# EAGLE design PicKit2Clone2 (EAGLE 6.5.0)
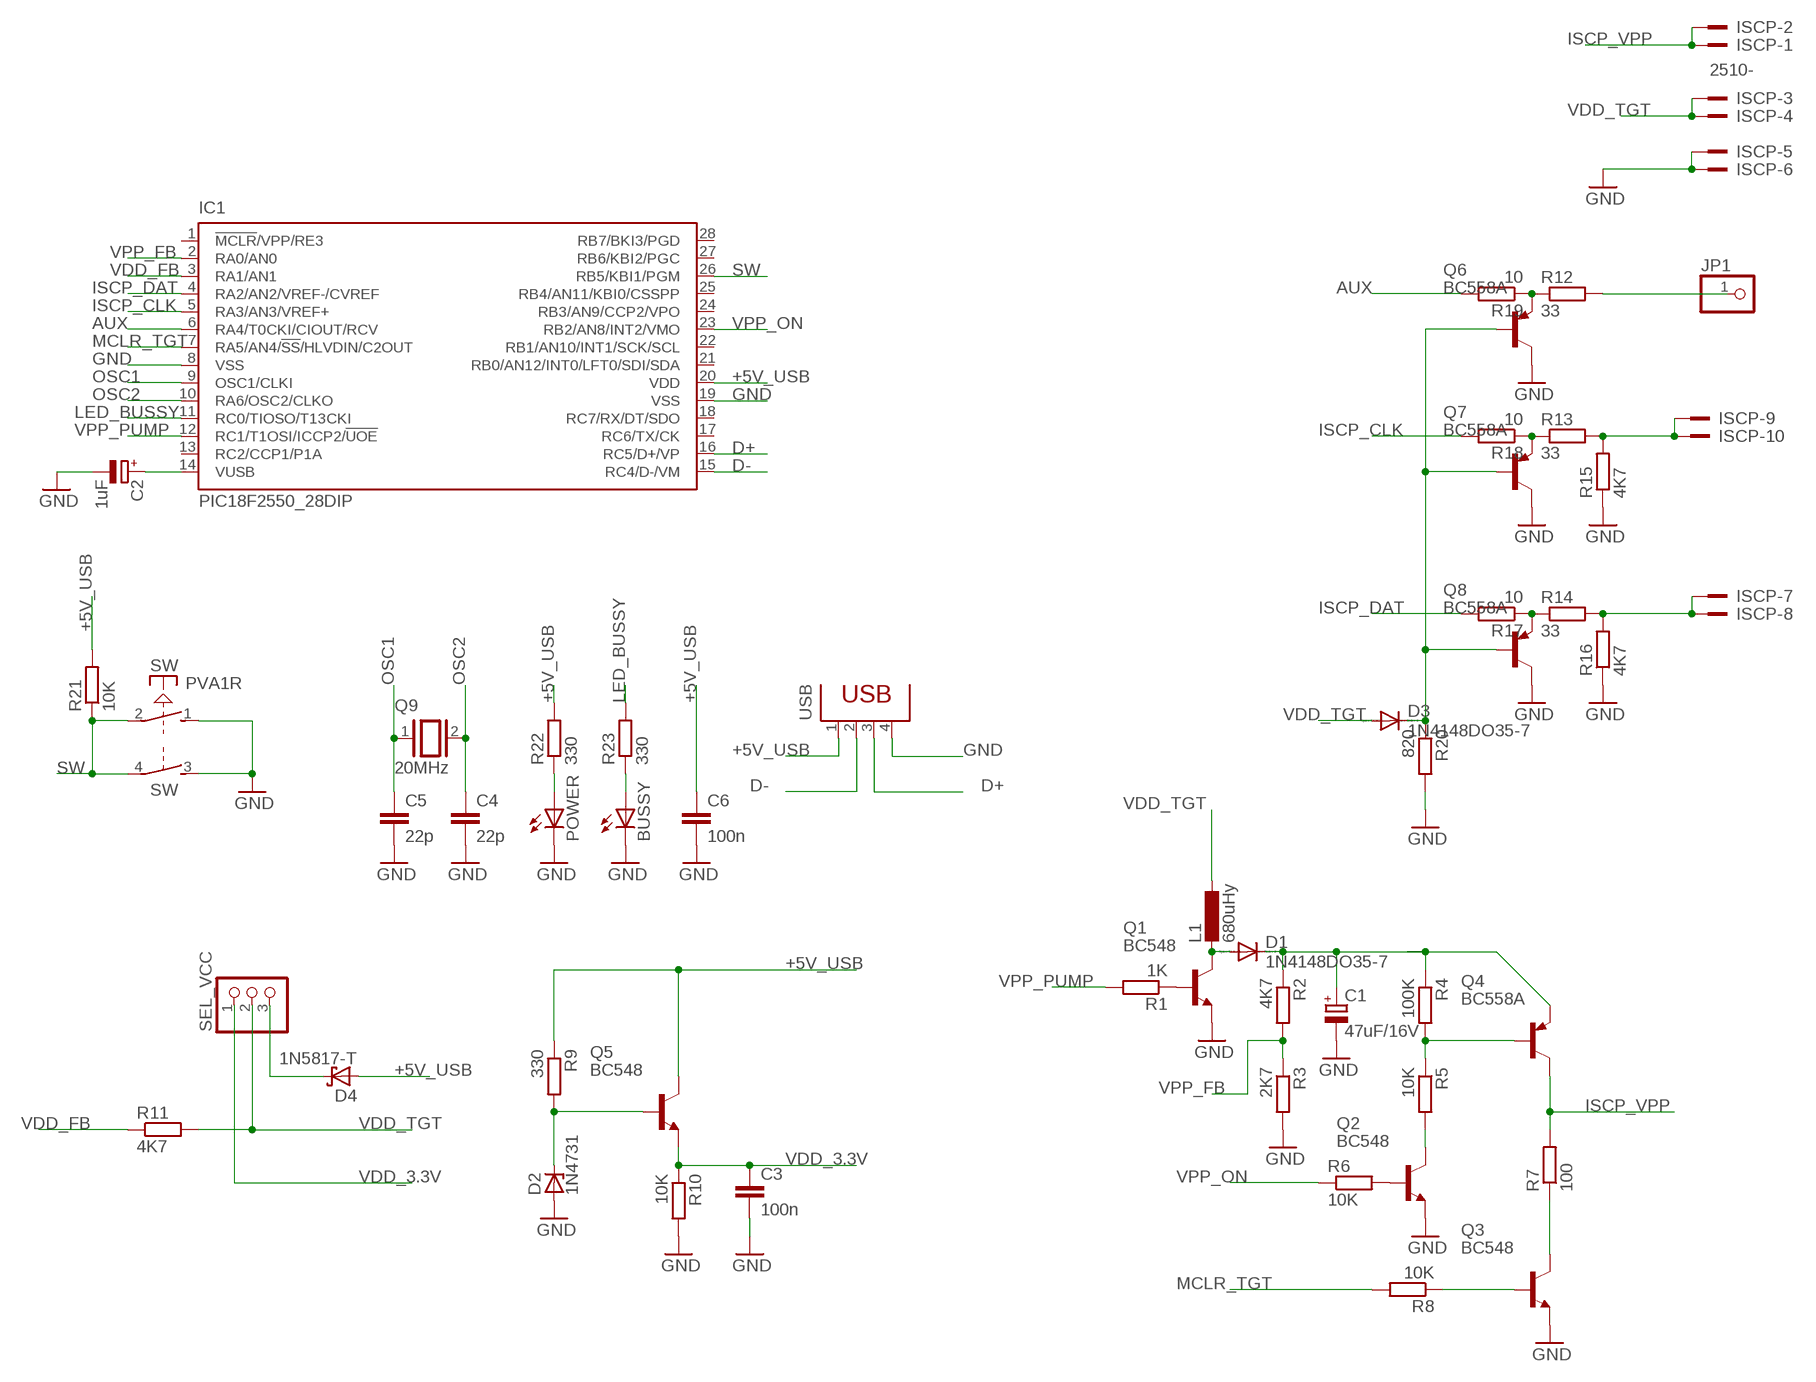
[diagram p0: schematic, sheet 1]

## Parts
BUSSY  LED5MM  [LED5MM]
C1  47uF/16V  CPOL-EUE1.8-4  [E1,8-4]
C2  1uF  CPOL-EUE1.8-4  [E1,8-4]
C3  100n  C-EU025-025X050  [C025-025X050]
C4  22p  C-EU025-024X044  [C025-024X044]
C5  22p  C-EU025-024X044  [C025-024X044]
C6  100n  C-EU025-024X044  [C025-024X044]
D1  1N4148DO35-7  [DO35-7]
D2  1N4731  ZENER-DIODEDO41Z10  [DO41Z10]
D3  1N4148DO35-7  [DO35-7]
D4  1N5817-T  [DO41-7.6]
IC1  PIC18F2550_28DIP  [DIL28-3]
ISCP  2510-  [PAK100/2500-10]
JP1  PINHD-1X1  [1X01]
L1  680uHy  L-EU0204/5  [0204/5]
POWER  LED5MM  [LED5MM]
Q1  BC548  [TO92-EBC]
Q2  BC548  [TO92-EBC]
Q3  BC548  [TO92-EBC]
Q4  BC558A  [TO92-EBC]
Q5  BC548  [TO92-EBC]
Q6  BC558A  [TO92-EBC]
Q7  BC558A  [TO92-EBC]
Q8  BC558A  [TO92-EBC]
Q9  20MHz  XTAL/S  [QS]
R1  1K  R-EU_0204/5  [0204/5]
R2  4K7  R-EU_0204/5  [0204/5]
R3  2K7  R-EU_0204/5  [0204/5]
R4  100K  R-EU_0204/5  [0204/5]
R5  10K  R-EU_0204/5  [0204/5]
R6  10K  R-EU_0204/7  [0204/7]
R7  100  R-EU_0204/5  [0204/5]
R8  10K  R-EU_0204/7  [0204/7]
R9  330  R-EU_0204/7  [0204/7]
R10  10K  R-EU_0204/5  [0204/5]
R11  4K7  R-EU_0204/5  [0204/5]
R12  33  R-EU_0204/5  [0204/5]
R13  33  R-EU_0204/5  [0204/5]
R14  33  R-EU_0204/7  [0204/7]
R15  4K7  R-EU_0204/5  [0204/5]
R16  4K7  R-EU_0204/7  [0204/7]
R17  10  R-EU_0204/5  [0204/5]
R18  10  R-EU_0204/5  [0204/5]
R19  10  R-EU_0204/5  [0204/5]
R20  820  R-EU_0204/5  [0204/5]
R21  10K  R-EU_0204/5  [0204/5]
R22  330  R-EU_0204/5  [0204/5]
R23  330  R-EU_0204/5  [0204/5]
SEL_VCC  PINHD-1X3  [1X03]
SW  PVA1R  [PVA1R]
USB  PN61729  [PN61729]

## Nets
+5V_USB: C6.1 D4.A IC1.20(VDD) Q5.C R9.1 R21.2 R22.2 USB.1
AUX: IC1.6(RA4/T0CKI/CIOUT/RCV) R19.2
D+: IC1.16(RC5/D+/VP) USB.3
D-: IC1.15(RC4/D-/VM) USB.2
GND: BUSSY.K(C) C1.- C2.- C3.2 C4.2 C5.2 C6.2 D2.A IC1.8(VSS) IC1.19(VSS) ISCP.5 ISCP.6 POWER.K(C) Q1.E Q2.E Q3.E Q6.C Q7.C Q8.C R3.2 R10.2 R15.1 R16.1 R20.2 SW.1(1:S) SW.3(2:S) USB.4
ISCP_CLK: IC1.5(RA3/AN3/VREF+) R18.2
ISCP_DAT: IC1.4(RA2/AN2/VREF-/CVREF) R17.2
ISCP_VPP: ISCP.1 ISCP.2 Q4.C R7.2
LED_BUSSY: IC1.11(RC0/TIOSO/T13CKI) R23.2
MCLR_TGT: IC1.7(RA5/AN4/!SS!/HLVDIN/C2OUT) R8.2
N$1: D1.A L1.2 Q1.C
N$2: Q1.B R1.1
N$3: C1.+ D1.C Q4.E R2.1 R4.1
N$4: Q4.B R4.2 R5.1
N$5: D2.C Q5.B R9.2
N$6: Q2.C R5.2
N$7: Q2.B R6.2
N$8: Q3.B R8.1
N$9: Q3.C R7.1
N$10: C2.+ IC1.14(VUSB)
N$11: D4.C SEL_VCC.3
N$12: Q6.E R12.1 R19.1
N$13: Q7.E R13.1 R18.1
N$14: Q8.E R14.1 R17.1
N$15: ISCP.9 ISCP.10 R13.2 R15.2
N$16: ISCP.7 ISCP.8 R14.2 R16.2
N$20: D3.C Q6.B Q7.B Q8.B R20.1
N$21: JP1.1 R12.2
N$22: BUSSY.A R23.1
N$23: POWER.A R22.1
OSC1: C5.1 IC1.9(OSC1/CLKI) Q9.1
OSC2: C4.1 IC1.10(RA6/OSC2/CLKO) Q9.2
SW: IC1.26(RB5/KBI1/PGM) R21.1 SW.2(1:P) SW.4(2:P)
VDD_3.3V: C3.1 Q5.E R10.1 SEL_VCC.1
VDD_FB: IC1.3(RA1/AN1) R11.1
VDD_TGT: D3.A ISCP.3 ISCP.4 L1.1 R11.2 SEL_VCC.2
VPP_FB: IC1.2(RA0/AN0) R2.2 R3.1
VPP_ON: IC1.23(RB2/AN8/INT2/VMO) R6.1
VPP_PUMP: IC1.12(RC1/T1OSI/ICCP2/!UOE) R1.2
Unconnected: IC1.1(!MCLR!/VPP/RE3) IC1.13(RC2/CCP1/P1A) IC1.17(RC6/TX/CK) IC1.18(RC7/RX/DT/SDO) IC1.21(RB0/AN12/INT0/LFT0/SDI/SDA) IC1.22(RB1/AN10/INT1/SCK/SCL) IC1.24(RB3/AN9/CCP2/VPO) IC1.25(RB4/AN11/KBI0/CSSPP) IC1.27(RB6/KBI2/PGC) IC1.28(RB7/BKI3/PGD)

## Library data of the parts
BUSSY POWER = led:LED: LED OSRAM: - CHIPLED LG R971, LG N971, LY N971, LG Q971, LY Q971, LO R971, LY R971 LH N974, LH R974 LS Q976, LO Q976, LY Q976 LO Q996 - Hyper CHIPLED LW Q18S LB Q993, LB Q99A, LB R99A - SideLED LS A670, LO A670, LY A670, LG A670, LP A670 LB A673, LV A673, LT A673, LW A673 LH A674 LY A675 LS A676, LA A676, LO A676, LY A676, LW A676 LS A679, LY A679, LG A679 - Hyper Micro SIDELED® LS Y876, LA Y876, LO Y876, LY Y876 LT Y87S - SmartLED LW L88C, LW L88S LB L89C, LB L89S, LG L890 LS L89K, LO L89K, LY L89K LS L896, LA L896, LO L896, LY L896 - TOPLED LS T670, LO T670, LY T670, LG T670, LP T670 LSG T670, LSP T670, LSY T670, LOP T670, LYG T670 LG T671, LOG T671, LSG T671 LB T673, LV T673, LT T673, LW T673 LH T674 LS T676, LA T676, LO T676, LY T676, LB T676, LH T676, LSB T676, LW T676 LB T67C, LV T67C, LT T67C, LS T67K, LO T67K, LY T67K, LW E67C LS E67B, LA E67B, LO E67B, LY E67B, LB E67C, LV E67C, LT E67C LW T67C LS T679, LY T679, LG T679 LS T770, LO T770, LY T770, LG T770, LP T770 LB T773, LV T773, LT T773, LW T773 LH T774 LS E675, LA E675, LY E675, LS T675 LS T776, LA T776, LO T776, LY T776, LB T776 LHGB T686 LT T68C, LB T68C - Hyper Mini TOPLED® LB M676 - Mini TOPLED Santana® LG M470 LS M47K, LO M47K, LY M47K Source: http://www.osram.convergy.de LUXEON: - LUMILED® LXK2-PW12-R00, LXK2-PW12-S00, LXK2-PW14-U00, LXK2-PW14-V00 LXK2-PM12-R00, LXK2-PM12-S00, LXK2-PM14-U00 LXK2-PE12-Q00, LXK2-PE12-R00, LXK2-PE12-S00, LXK2-PE14-T00, LXK2-PE14-U00 LXK2-PB12-K00, LXK2-PB12-L00, LXK2-PB12-M00, LXK2-PB14-N00, LXK2-PB14-P00, LXK2-PB14-Q00 LXK2-PR12-L00, LXK2-PR12-M00, LXK2-PR14-Q00, LXK2-PR14-R00 LXK2-PD12-Q00, LXK2-PD12-R00, LXK2-PD12-S00 LXK2-PH12-R00, LXK2-PH12-S00 LXK2-PL12-P00, LXK2-PL12-Q00, LXK2-PL12-R00 Source: www.luxeon.com KINGBRIGHT: KA-3528ASYC Source: www.kingbright.com
C1 C2 = rcl:CPOL-EU: POLARIZED CAPACITOR, European symbol
C3-C6 = rcl:C-EU: CAPACITOR, European symbol
D1 D3 = diode:1N4148: DIODE high speed (Philips)
D2 = diode:ZENER-DIODE: Z-Diode
D4 = diode:1N581*: 1.0A SCHOTTKY BARRIER RECTIFIER Source: http://www.diodes.com/datasheets/ds23001.pdf
IC1 = microchip:PIC18F2*_28: USB Microcontrollers with nanoWatt Technology High-Performance, Enhanced Flash, 28/40/44-Pin, Source: http://ww1.microchip.com/downloads/en/devicedoc/39632c.pdf; MF: MICROCHIP; MPN: PIC18F2550-I/SP; OC_FARNELL: 1523822; OC_NEWARK: 80K6054
ISCP = con-3m:2510-: 3M (TM) Pak 100 4-Wall Header Source: 3M; MF: 3M; MPN: 2510-6002UB; OC_FARNELL: 9838244; OC_NEWARK: 46F4725
JP1 = pinhead:PINHD-1X1: PIN HEADER
L1 = rcl:L-EU: INDUCTOR, European symbol
Q1-Q3 Q5 = transistor-npn:BC548*: NPN Transistor
Q4 Q6-Q8 = transistor-pnp:BC558*: PNP Transistror
Q9 = special:XTAL/S: CRYSTAL
R1-R23 = resistor:R-EU_: RESISTOR, European symbol
SEL_VCC = pinhead:PINHD-1X3: PIN HEADER
SW = switch-misc:PVA1R: ITT SWITCH
USB = con-berg:PN61729: BERG USB connector; OC_FARNELL: unknown; OC_NEWARK: unknown

## Board
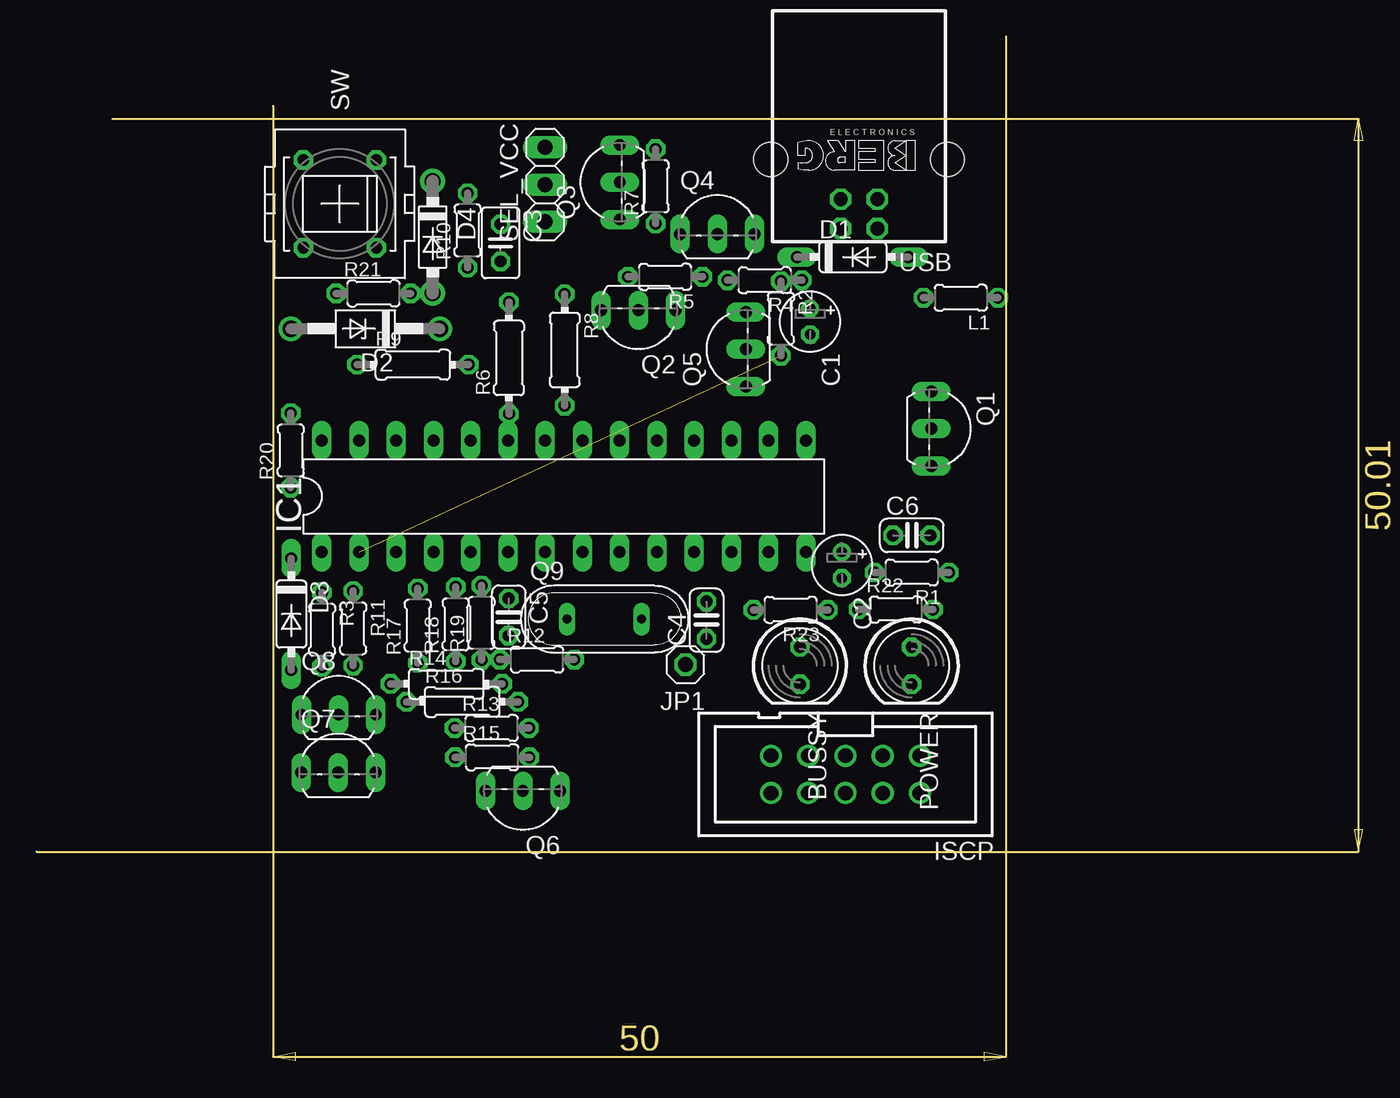
[diagram p1: board, top side]
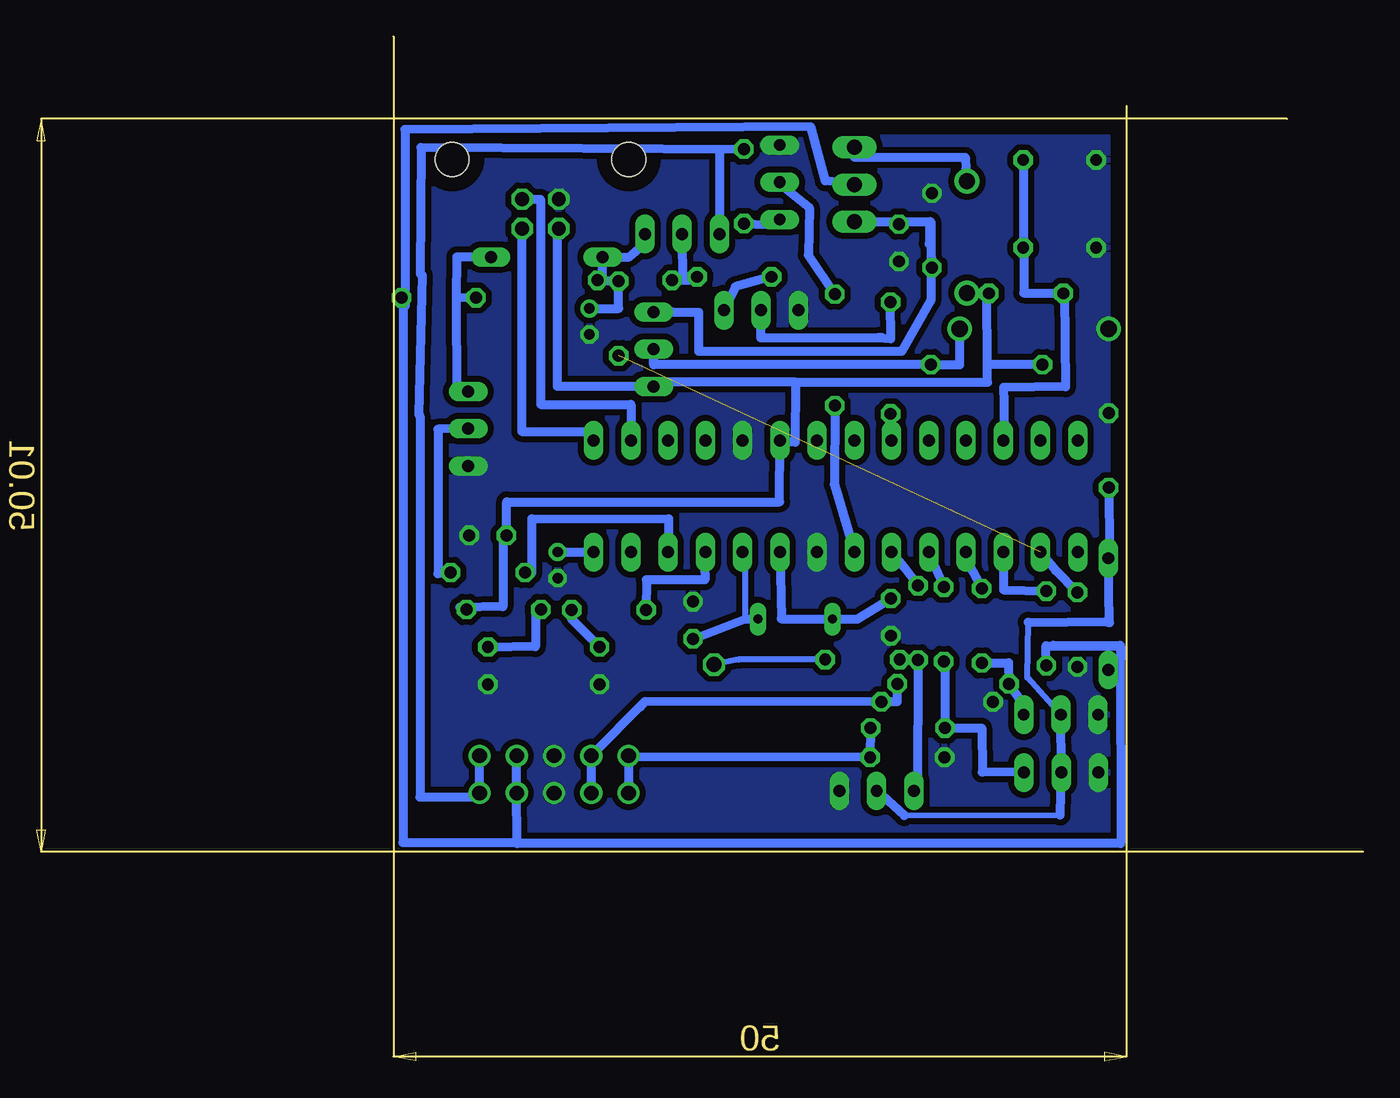
[diagram p2: board, bottom side, seen from below]

Size 90.47 x 69.88 mm. Coordinates in mm from the lower left corner, seen from the top.
Copper layers (1*16): Top 0.035mm / dielectric 1.5mm / Bottom 0.035mm
Design rules "default *": minimum track width 10mil, minimum drill 24mil, track to track 16mil, track to pad 16mil, pad to pad 8mil, via to via 8mil, smd to smd 8mil, copper to edge 40mil, drill to drill 8mil, minimum pad ring 10mil, minimum via ring 8mil, stop-mask expansion 4mil, vias tented up to drill 0mil, thermal gap 1mil

### Footprints (pad centres in the part's own frame; a part is rotated, then mirrored left to right if it is on the bottom)
LED5MM = drill 0.813 octagon: A -1.27,0; K 1.27,0
E1,8-4 = drill 0.711 pad 1.168: + -0.889,0 | drill 0.711 pad 1.168 octagon: - 0.889,0
C025-025X050 = drill 0.813 octagon: 1 -1.27,0; 2 1.27,0
C025-024X044 = drill 0.813 octagon: 1 -1.27,0; 2 1.27,0
DO35-7 = drill 0.813 long: A 3.81,0; C -3.81,0
DO41Z10 = drill 1.118: A 5.08,0; C -5.08,0
DO41-7.6 = drill 1.1 pad 1.7: A 3.81,0; C -3.81,0
DIL28-3 = drill 0.813 long: 1 -16.51,-3.81; 2 -13.97,-3.81; 3 -11.43,-3.81; 4 -8.89,-3.81; 5 -6.35,-3.81; 6 -3.81,-3.81; 7 -1.27,-3.81; 8 1.27,-3.81; 9 3.81,-3.81; 10 6.35,-3.81; 11 8.89,-3.81; 12 11.43,-3.81; 13 13.97,-3.81; 14 16.51,-3.81; 15 16.51,3.81; 16 13.97,3.81; 17 11.43,3.81; 18 8.89,3.81; 19 6.35,3.81; 20 3.81,3.81; 21 1.27,3.81; 22 -1.27,3.81; 23 -3.81,3.81; 24 -6.35,3.81; 25 -8.89,3.81; 26 -11.43,3.81; 27 -13.97,3.81; 28 -16.51,3.81
PAK100/2500-10 = drill 1 pad 1.422: 1 -5.08,-1.27; 2 -5.08,1.27; 3 -2.54,-1.27; 4 -2.54,1.27; 5 0,-1.27; 6 0,1.27; 7 2.54,-1.27; 8 2.54,1.27; 9 5.08,-1.27; 10 5.08,1.27
1X01 = drill 1.016 octagon: 1 0,0
0204/5 = drill 0.813 octagon: 1 -2.54,0; 2 2.54,0
TO92-EBC = drill 0.813 long: B 0,-1.27; C -2.54,-1.27; E 2.54,-1.27
QS = drill 0.61 long: 1 -2.54,0; 2 2.54,0
0204/7 = drill 0.813 octagon: 1 -3.81,0; 2 3.81,0
1X03 = drill 1.016 long: 1 -2.54,0; 2 0,0; 3 2.54,0
PVA1R = drill 0.813 octagon: 1 -2.997,2.489; 2 -2.997,-2.489; 3 2.997,2.489; 4 2.997,-2.489
PN61729 = drill 0.95 octagon: 1 1.25,4.71; 2 -1.25,4.71; 3 -1.25,2.71; 4 1.25,2.71 | hole 2.3: -6.02,0; 6.02,0

### Placement (x,y rotation side)
BUSSY  52.07,26.97 270 top
C1  52.76,50.45 270 top
C2  54.93,33.83 270 top
C3  31.64,55.82 270 top
C4  45.69,30.07 90 top
C5  32.2,30.28 270 top
C6  59.69,35.86 0 top
D1  55.67,54.85 0 top
D2  22.42,49.95 180 top
D3  17.37,30.49 270 top
D4  27.02,56.21 270 top
IC1  35.96,38.52 0 top
ISCP  55.18,19.55 180 top
JP1  44.27,27.04 180 top
L1  63.04,52.06 180 top
POWER  59.69,26.97 270 top
Q1  62.3,43.14 270 top
Q2  41.05,49.95 180 top
Q3  38.51,59.95 90 top
Q4  46.44,57.69 0 top
Q5  47.11,48.56 90 top
Q6  33.17,17.15 180 top
Q7  20.57,20.95 0 top
Q8  20.6,24.89 0 top
Q9  38.73,30.15 0 top
R1  59.69,33.32 180 top
R2  50.77,50.66 270 top
R3  19.47,29.43 270 top
R4  49.67,53.26 180 top
R5  42.87,53.49 180 top
R6  32.22,47.96 90 top
R7  42.23,59.67 90 top
R8  36.02,48.51 270 top
R9  25.66,47.5 0 top
R10  29.4,56.66 90 top
R11  21.59,29.51 270 top
R12  34.14,27.38 0 top
R13  31.04,22.71 0 top
R14  27.95,25.73 0 top
R15  31.07,20.72 0 top
R16  29.04,24.5 0 top
R17  26,29.7 90 top
R18  28.59,29.79 90 top
R19  30.34,29.89 90 top
R20  17.34,41.65 90 top
R21  22.98,52.37 0 top
R22  58.61,30.8 0 top
R23  51.44,30.78 180 top
SEL_VCC  34.68,59.79 90 top
SW  20.68,58.47 90 top
USB  56.1,61.5 180 top

### Tracks (layer width: path | path; a pad name or v marks a point on that pad's centre or on a via)
+5V_USB
  Bottom 0.61: R22.2 61.6,30.94 58.66,31 58.64,35.81 C6.1 58.4,35.86 58.4,38.14 39.79,38.14 IC1.20 38.72,42.21 38.68,46.31 | R21.2 25.63,52.37 | 25.63,52.37 26.26,52.37 D4.A | USB.1 54.96,56.79 54.96,46.02 Q5.C | 48.38,45.95 Q5.C | 38.68,46.31 25.6,46.31 25.6,47.48 | 25.6,47.48 25.63,52.37 | 38.68,46.31 48.38,46.31 Q5.C | R9.1 25.6,47.51 25.6,47.48
AUX
  Bottom 0.61: IC1.6 31.35,33.73 R19.2
D+
  Bottom 0.61: USB.3 56.11,58.79 56.08,44.8 49.94,44.8 IC1.16
D-
  Bottom 0.61: USB.2 57.32,56.77 57.38,56.77 57.38,42.95 52.45,42.95 IC1.15
GND
  pour Bottom: 16.13,65.16 67.19,64.96 67.83,13.45 16.21,13.76
ISCP_CLK
  Bottom 0.61: IC1.5 29.26,33.87 R18.2
ISCP_DAT
  Bottom 0.61: IC1.4 26.82,33.72 R17.2
ISCP_VPP
  Bottom 0.61: R7.2 42.19,62.2 | 42.19,62.2 42.17,62.18 64.25,62.32 64.3,53.7 64.16,53.59 64.41,44.11 64.32,44.01 64.32,18 60.26,18.03 ISCP.2 ISCP.1 | 42.19,62.2 43.89,62.16 Q4.C
LED_BUSSY
  Bottom 0.61: IC1.11 44.93,34.84 44.89,32.82 48.87,32.82 R23.2
MCLR_TGT
  Bottom 0.61: R8.2 36.05,39.33 IC1.7
N$1
  Bottom 0.61: D1.A 61.81,54.85 61.86,52.04 | 61.86,52.04 61.83,45.6 61.03,45.6 Q1.C | L1.2 61.86,52.04
N$2
  Bottom 0.61: Q1.B 63.09,43.1 63.09,33.25 62.23,33.28 R1.1
N$3
  Bottom 0.61: C1.+ 50.77,51.34 R2.1 51.86,53.2 | 51.86,53.2 52.21,53.2 R4.1 | Q4.E 48.98,56.26 49.11,55.65 50.07,54.84 D1.C 51.86,53.2
N$4
  Bottom 0.61: R4.2 46.39,53.26 | 46.39,53.26 46.02,53.26 R5.1 | Q4.B 46.45,56.16 46.39,53.26
N$5
  Bottom 0.61: 48.34,47.56 Q5.B 48.38,47.51 R9.2 27.51,47.51 D2.C
N$6
  Bottom 0.61: R5.2 42.81,52.83 Q2.C
N$7
  Bottom 0.61: Q2.B 41.08,49.34 32.74,49.34 33.12,49.35 32.2,49.27 R6.2
N$8
  Bottom 0.61: Q3.B 39.96,59.99 37.76,58.21 37.82,54.99 R8.1
N$9
  Bottom 0.61: R7.1 40.64,57.06 Q3.C
N$10
  Bottom 0.61: C2.+ IC1.14
N$11
  Bottom 0.61: SEL_VCC.3 34.71,61.66 27.12,61.65 27.09,60.82 D4.C
N$12
  Bottom 0.61: R12.1 R19.1 30.37,18.44 Q6.E
N$13
  Bottom 0.61: R18.1 28.5,27.25 R13.1 26,22.71 25.96,19.71 Q7.E
N$14
  Bottom 0.61: R17.1 24.18,27.16 R14.1 23.17,24.34 Q8.E
N$15
  Bottom 0.61: R13.2 R15.2 50.23,20.75 | 50.23,20.75 ISCP.9 | 50.23,20.75 50.1,20.62 ISCP.10
N$16
  Bottom 0.61: 49.32,24.13 48.97,24.51 | 48.97,24.51 ISCP.7 ISCP.8 | R14.2 31.77,24.51 R16.2 48.97,24.51
N$20
  Bottom 0.406: Q8.B 22.9,26.16 22.83,29.94 | 31.28,16.75 20.65,16.78
  Bottom 0.61: R20.1 17.28,34.88 D3.C 17.28,29.89 17.49,29.99 22.81,29.93 22.83,29.94 | Q6.B 33.18,18.5 31.28,16.75 | 20.65,16.78 Q7.B 20.56,19.75 Q8.B
N$21
  Bottom 0.406: R12.2 42.59,27.38 JP1.1
N$22
  Bottom 0.61: R23.1 53.97,30.15 BUSSY.A
N$23
  Bottom 0.61: R22.1 56.45,30.84 56.45,28.27 59.69,28.2 POWER.A
OSC1
  Bottom 0.61: IC1.9 39.67,30.16 Q9.1 34.49,30.15 C5.1
OSC2
  Bottom 0.406: IC1.10 42.16,34.71 42.16,30.15
  Bottom 0.61: C4.1 42.16,30.15 Q9.2
SW
  Bottom 0.61: SW.4 SW.2 23.13,55.86 23.13,52.4 20.44,52.4 R21.1 20.37,52.37 20.28,46 24.51,45.94 24.48,44.9 24.46,42.3 IC1.26
VDD_3.3V
  Bottom 0.61: 47.13,51.1 Q5.E 48.38,51.06 45.29,51.06 45.29,48.4 31.46,48.4 29.48,51.86 29.48,57.24 | 29.52,55.67 29.57,55.76 29.57,57.25 | R10.1 29.48,57.24 | 29.48,57.24 29.48,57.25 29.57,57.25 | SEL_VCC.1 31.62,57.25 | 31.62,57.25 29.57,57.25 | C3.1 31.62,57.46 31.62,57.25
VDD_FB
  Bottom 0.61: IC1.3 24.52,32.14 R11.1
VDD_TGT
  Bottom 0.61: SEL_VCC.2 36.68,60.05 37.66,63.73 65.34,63.54 65.34,51.47 | 65.34,51.47 65.35,52.05 L1.1 | ISCP.3 ISCP.4 57.7,15.07 | R11.2 21.61,28.32 | 21.61,28.32 21.12,28.35 16.55,28.35 16.48,28.24 16.53,27.05 D3.A | 21.61,28.32 16.54,28.32 16.52,14.84 57.7,14.84 57.7,15.07 | 65.34,51.47 65.49,51.47 65.49,14.91 57.7,14.91 57.7,15.07
VPP_FB  (1 unrouted)
  Bottom 0.61: IC1.2 20.95,33.45 R3.1
VPP_ON
  Bottom 0.61: R6.1 32.1,42.64 IC1.23
VPP_PUMP
  Bottom 0.61: R1.2 56.68,33.32 56.68,36.98 47.35,37.01 IC1.12